# EAGLE schematic Joy2PS2_rev2_3 (EAGLE 7.6.0)
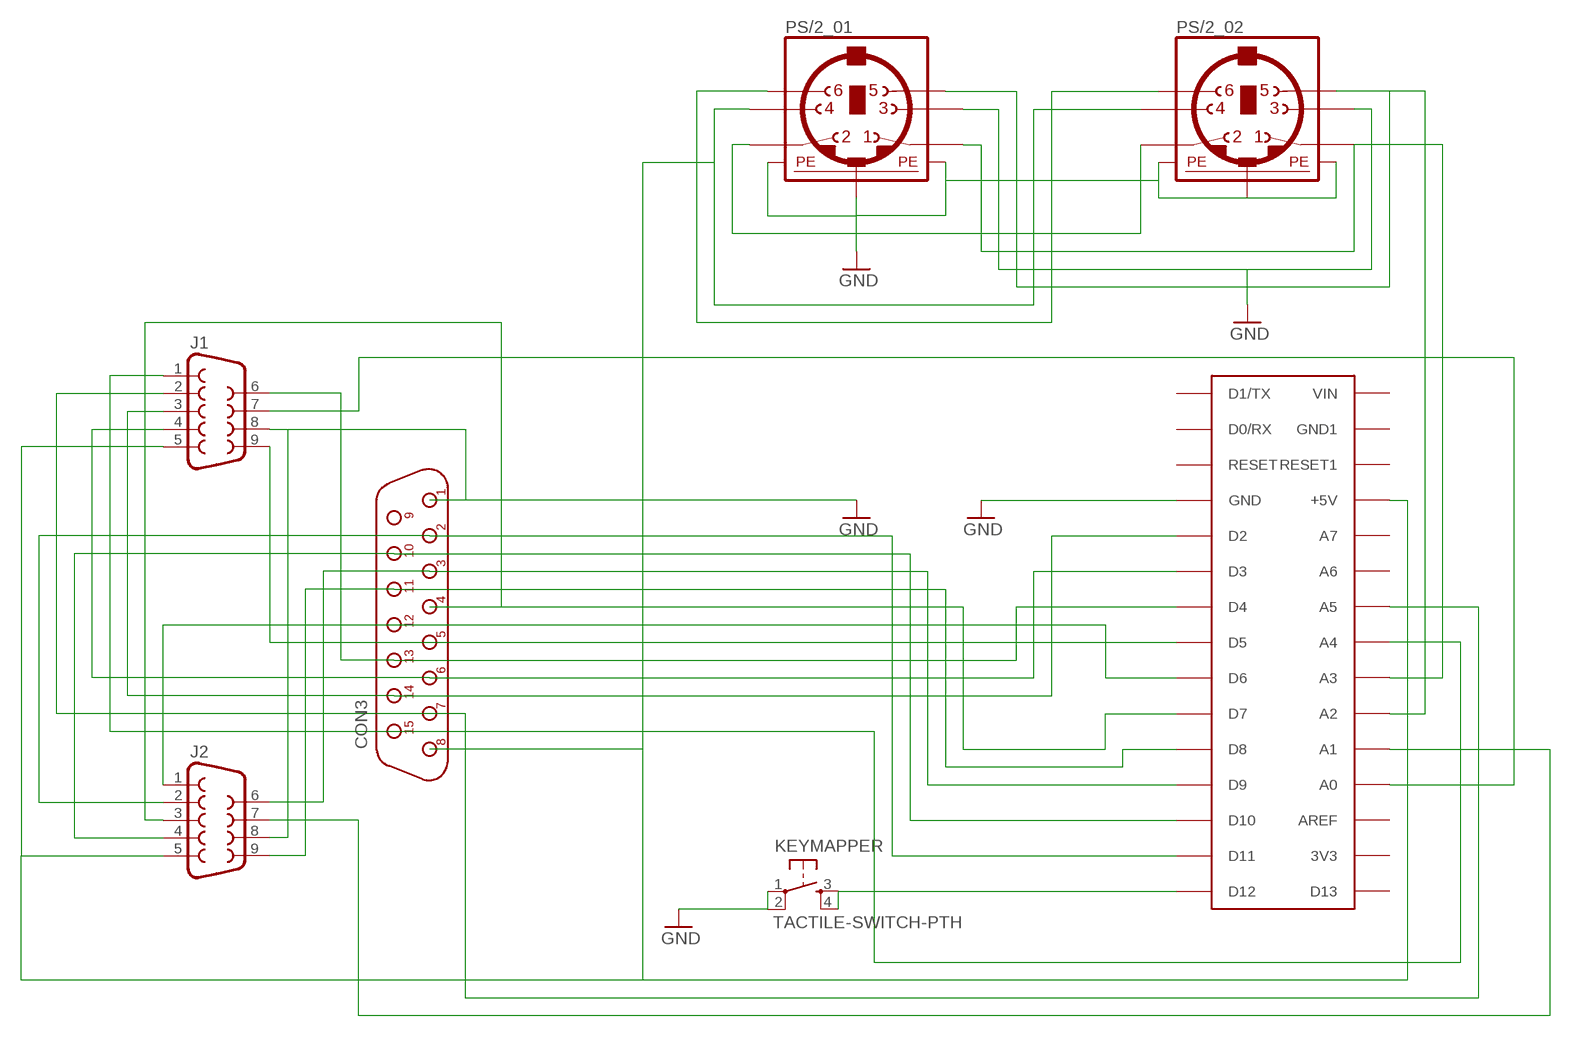
[diagram p0: schematic, sheet 1]

## Parts
ARDUINONANO  ARDUINONANO  [PDIP-32]
CON3  DB15M/90  [D-15M/90]
J1  DB9MALE  [DB9_MALE]
J2  DB9MALE  [DB9_MALE]
KEYMAPPER  TACTILE-SWITCH-PTH  [TAC-SWITCH-PTH]
PS/2_01  MINI_DIN_6  [M_DIN6]
PS/2_02  MINI_DIN_6  [M_DIN6]

## Nets
GND: ARDUINONANO.GND CON3.1 J1.8 J2.8 KEYMAPPER.1 KEYMAPPER.2 PS/2_01.3 PS/2_01.SH1(PE1) PS/2_01.SH2(PE2) PS/2_01.SH3(PE3) PS/2_02.3 PS/2_02.SH1(PE1) PS/2_02.SH2(PE2) PS/2_02.SH3(PE3)
N$1: ARDUINONANO.A3 PS/2_01.1 PS/2_02.1
N$2: PS/2_01.2 PS/2_02.2
N$3: ARDUINONANO.+5V CON3.8 J1.5 J2.5 PS/2_01.4 PS/2_02.4
N$4: ARDUINONANO.A0 J1.7
N$5: ARDUINONANO.A2 PS/2_01.5 PS/2_02.5
N$6: ARDUINONANO.D10 CON3.10 J2.4
N$7: ARDUINONANO.D8 CON3.11 J2.9
N$8: ARDUINONANO.A1 J2.7
N$9: ARDUINONANO.A5 CON3.7 J1.2
N$10: ARDUINONANO.D2 CON3.14 J1.3
N$11: ARDUINONANO.D3 CON3.6 J1.4
N$12: ARDUINONANO.D4 CON3.13 J1.6
N$13: ARDUINONANO.D5 CON3.5 J1.9
N$14: ARDUINONANO.D6 CON3.12 J2.1
N$15: ARDUINONANO.D7 CON3.4 J2.3
N$16: ARDUINONANO.D9 CON3.3 J2.6
N$17: ARDUINONANO.D11 CON3.2 J2.2
N$18: ARDUINONANO.A4 CON3.15 J1.1
N$19: ARDUINONANO.D12 KEYMAPPER.3 KEYMAPPER.4
N$20: PS/2_01.6 PS/2_02.6
Unconnected: ARDUINONANO.3V3 ARDUINONANO.A6 ARDUINONANO.A7 ARDUINONANO.AREF ARDUINONANO.D0/RX ARDUINONANO.D1/TX ARDUINONANO.D13 ARDUINONANO.GND1 ARDUINONANO.RESET ARDUINONANO.RESET1 ARDUINONANO.VIN CON3.9

## Library data of the parts
ARDUINONANO = jet-lib2:ARDUINONANO
CON3 = connect:DB15M/90
J1 J2 = SparkFun-Connectors:DB9: DB9 Connector Standard DB9 (D-Sub 9) serial connector. Can be used for CAN bus as well as RS485 and RS232. Footprint production proven. Spark Fun Electronics SKU : PRT-00429; PROD_ID: CONN-09904
KEYMAPPER = GeekAmmo:TACTILE-SWITCH: Tactile Switch 4 Pins, SPST NO
PS/2_01 PS/2_02 = mini_din:MINI_DIN_6